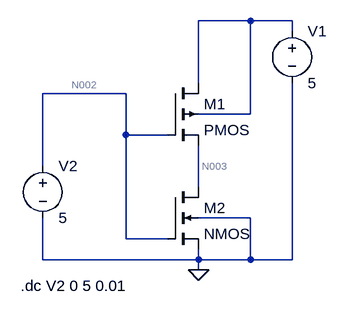
[diagram p0: schematic inv.asc]
inv.asc, the LTspice schematic file:
Version 4
SHEET 1 880 680
WIRE 304 -96 224 -96
WIRE 368 -96 304 -96
WIRE 368 -80 368 -96
WIRE 224 0 224 -96
WIRE 112 16 -16 16
WIRE 304 48 304 -96
WIRE 304 48 224 48
WIRE 112 80 112 16
WIRE 176 80 112 80
WIRE -16 128 -16 16
WIRE 224 160 224 96
WIRE 304 208 224 208
WIRE 112 240 112 80
WIRE 176 240 112 240
WIRE -16 272 -16 208
WIRE 224 272 224 256
WIRE 224 272 -16 272
WIRE 304 272 304 208
WIRE 304 272 224 272
WIRE 368 272 368 0
WIRE 368 272 304 272
WIRE 224 288 224 272
FLAG 224 288 0
SYMBOL voltage 368 -96 R0
WINDOW 123 0 0 Left 0
WINDOW 39 0 0 Left 0
SYMATTR InstName V1
SYMATTR Value 5
SYMBOL voltage -16 112 R0
WINDOW 123 0 0 Left 0
WINDOW 39 0 0 Left 0
SYMATTR InstName V2
SYMATTR Value 5
SYMBOL pmos4 176 0 R0
SYMATTR InstName M1
SYMBOL nmos4 176 160 R0
SYMATTR InstName M2
TEXT -50 312 Left 2 !.dc V2 0 5 0.01

The netlist it stands for:
* inv.asc
V1 N001 0 5
V2 N002 0 5
M1 N001 N002 N003 N001 PMOS
M2 N003 N002 0 0 NMOS
.model NMOS NMOS
.model PMOS PMOS
.lib standard.mos
.dc V2 0 5 0.01
.backanno
.end

* Results of the author's LTspice run, read from the files saved beside the schematic
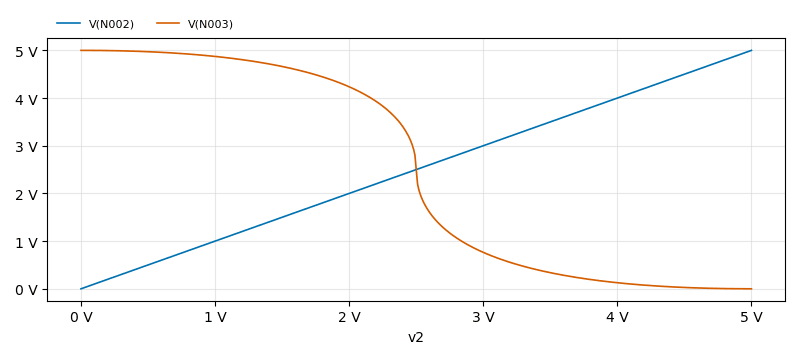
[diagram p1: DC transfer characteristic of inv.asc, plotted from the saved traces]
* DC transfer characteristic, 1 run:
*   V(N002): 0 V at v2=0 V, 5 V at v2=5 V, min 0 V, max 5 V
*   V(N003): 5 V at v2=0 V, 100.1 nV at v2=5 V, min 100.1 nV, max 5 V